# EAGLE design eagle (EAGLE 7.2.0)
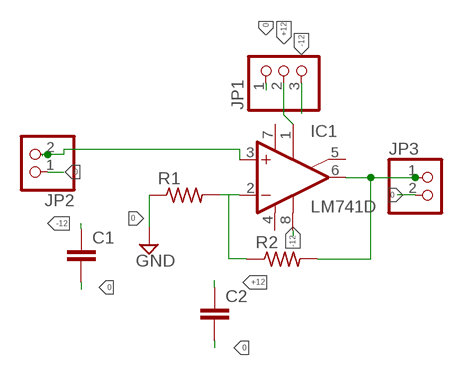
[diagram p0: schematic, sheet 1]

## Parts
C1  C-EU050-025X075  [C050-025X075]
C2  C-EU050-025X075  [C050-025X075]
IC1  LM741D  [SO08]
JP1  PINHD-1X3  [1X03]
JP2  PINHD-1X2  [1X02]
JP3  PINHD-1X2  [1X02]
R1  R-US_0207/10  [0207/10]
R2  R-US_0207/10  [0207/10]

## Nets
0: C1.2 C2.2 JP1.1 JP2.1 JP3.2 R1.1 ; supply symbol labelled GND
+12: C2.1 IC1.1(ON1) JP1.2
-12: C1.1 IC1.8(OPT) JP1.3
N$2: IC1.3(+IN) JP2.2
N$5: IC1.2(-IN) R1.2 R2.1
N$6: IC1.6(OUT) JP3.1 R2.2
Unconnected: IC1.5(ON2)

## Power pins joined to a net without a drawn wire
V+: IC1.7(V+)
V-: IC1.4(V-)

## Library data of the parts
C1 C2 = rcl:C-EU: CAPACITOR, European symbol
IC1 = linear:*741: OP AMP
JP1 = pinhead:PINHD-1X3: PIN HEADER
JP2 JP3 = pinhead:PINHD-1X2: PIN HEADER
R1 R2 = resistor:R-US_: RESISTOR, American symbol

## Board
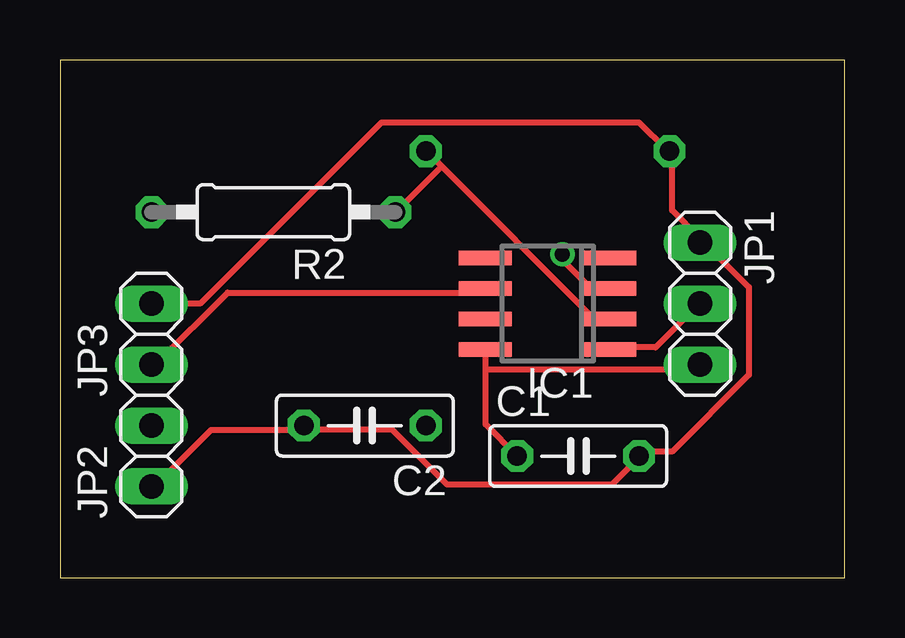
[diagram p1: board, top side]
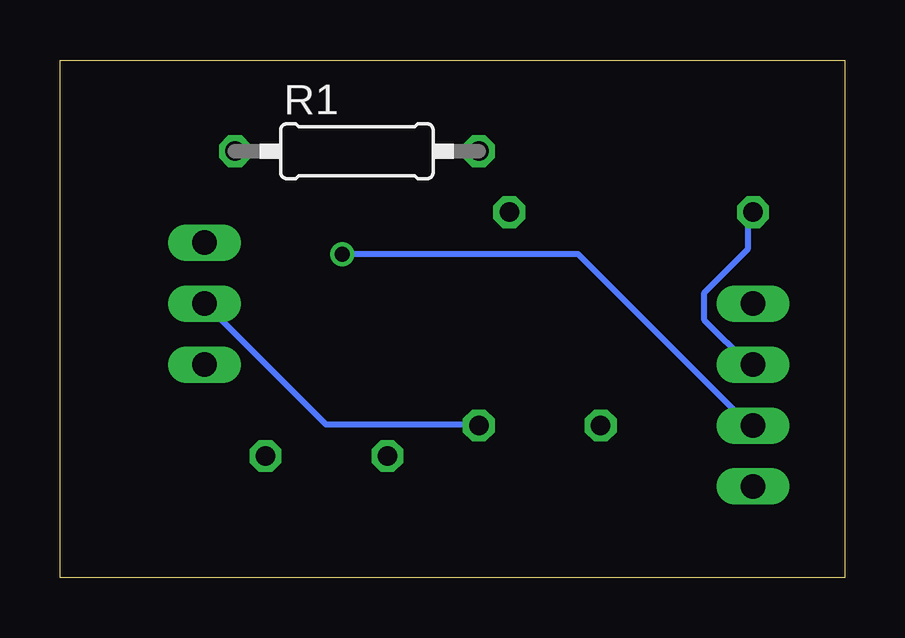
[diagram p2: board, bottom side, seen from below]

Size 32.69 x 21.58 mm. Coordinates in mm from the lower left corner, seen from the top.
Outline: 0,0 32.69,0 32.69,21.58 0,21.58 0,0
Copper layers (1*16): Top 0.035mm / dielectric 1.5mm / Bottom 0.035mm
Design rules "default": minimum track width 10mil, minimum drill 24mil, track to track 8mil, track to pad 8mil, pad to pad 8mil, via to via 8mil, smd to smd 8mil, copper to edge 40mil, drill to drill 8mil, minimum pad ring 10mil, minimum via ring 8mil, stop-mask expansion 4mil, vias tented up to drill 0mil, thermal gap 10mil

### Footprints (pad centres in the part's own frame; a part is rotated, then mirrored left to right if it is on the bottom)
C050-025X075 = drill 0.813 octagon: 1 -2.54,0; 2 2.54,0
SO08 = smd 0.6 x 2.2: 1 -1.905,-2.6; 2 -0.635,-2.6; 3 0.635,-2.6; 4 1.905,-2.6; 5 1.905,2.6; 6 0.635,2.6; 7 -0.635,2.6; 8 -1.905,2.6
1X03 = drill 1.016 long: 1 -2.54,0; 2 0,0; 3 2.54,0
1X02 = drill 1.016 long: 1 -1.27,0; 2 1.27,0
0207/10 = drill 0.813 octagon: 1 -5.08,0; 2 5.08,0

### Placement (x,y rotation side)
C1  21.59,5.08 0 top
C2  12.7,6.35 180 top
IC1  20.32,11.43 90 top
JP1  26.67,11.43 270 top
JP2  3.81,5.08 90 top
JP3  3.81,10.16 90 top
R1  20.32,17.78 0 bottom
R2  8.89,15.24 180 top

### Tracks (layer width: path | path; a pad name or v marks a point on that pad's centre or on a via)
0
  Top 0.254: JP2.1 4.01,3.89 6.3,6.17 9.96,6.17 C2.2 10.18,6.17 13.84,6.17 16.13,3.89 22.99,3.89 24.13,5.03 C1.2 24.13,5.26 25.5,5.26 28.7,8.46 28.7,12.12 26.87,13.95 JP1.1 26.64,14.17 25.5,15.32 25.5,17.6 R1.1 25.27,17.83 24.13,18.97 13.39,18.97 5.84,11.43 JP3.2
+12
  Top 0.254: IC1.1 22.99,9.6 24.82,9.6 26.64,11.43 JP1.2
  Bottom 0.254: C2.1 15.44,6.4 21.61,6.4 26.64,11.43 JP1.2
-12
  Top 0.254: 17.73,8.69 17.73,6.4 C1.1 | 17.73,8.69 17.73,9.37 IC1.8 | 17.73,8.69 26.64,8.69 JP1.3
N$2  (via drill 0.61)
  Top 0.254: v20.93,13.49 20.93,13.26 22.07,12.12 22.76,12.12 IC1.3
  Bottom 0.254: v20.93,13.49 11.1,13.49 4.01,6.4 JP2.2
N$5
  Top 0.254: 15.9,17.14 15.44,17.6 R1.2 | 15.9,17.14 22.07,10.97 22.76,10.97 IC1.2 | 15.9,17.14 14.07,15.32 R2.1
N$6
  Top 0.254: IC1.6 17.5,11.89 6.98,11.89 4.01,8.91 JP3.1
  Bottom 0.254: R2.2 4.01,15.09 4.01,13.72 5.84,11.89 5.84,10.74 4.01,8.91 JP3.1